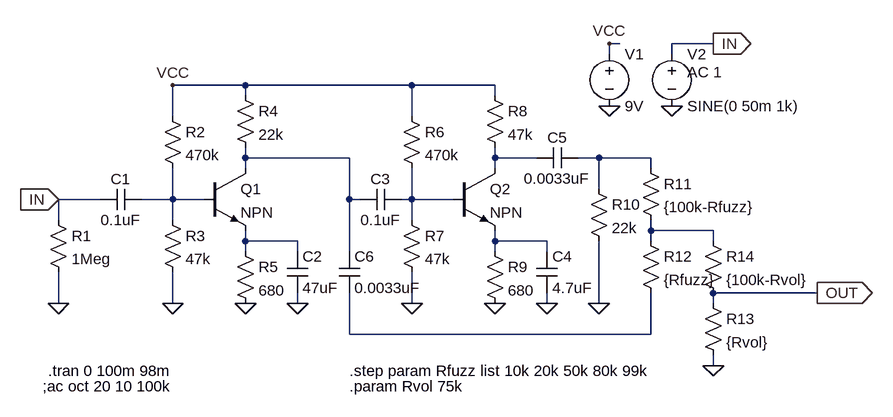
[diagram p0: schematic FoxeyLady.asc]
FoxeyLady.asc, the LTspice schematic file:
Version 4
SHEET 1 1396 680
WIRE 976 -208 960 -208
WIRE 1120 -208 1056 -208
WIRE 960 -192 960 -208
WIRE 1056 -192 1056 -208
WIRE 400 -144 288 -144
WIRE 656 -144 400 -144
WIRE 784 -144 656 -144
WIRE 400 -128 400 -144
WIRE 784 -128 784 -144
WIRE 288 -96 288 -144
WIRE 656 -96 656 -144
WIRE 400 -32 400 -48
WIRE 560 -32 400 -32
WIRE 784 -32 784 -48
WIRE 848 -32 784 -32
WIRE 944 -32 912 -32
WIRE 1024 -32 944 -32
WIRE 400 -16 400 -32
WIRE 784 -16 784 -32
WIRE 1024 -16 1024 -32
WIRE 944 16 944 -32
WIRE 176 32 112 32
WIRE 288 32 288 -16
WIRE 288 32 240 32
WIRE 336 32 288 32
WIRE 560 32 560 -32
WIRE 576 32 560 32
WIRE 656 32 656 -16
WIRE 656 32 640 32
WIRE 720 32 656 32
WIRE 112 64 112 32
WIRE 288 64 288 32
WIRE 656 64 656 32
WIRE 1024 80 1024 64
WIRE 1120 80 1024 80
WIRE 400 96 400 80
WIRE 480 96 400 96
WIRE 784 96 784 80
WIRE 864 96 784 96
WIRE 1024 96 1024 80
WIRE 1120 96 1120 80
WIRE 400 112 400 96
WIRE 480 112 480 96
WIRE 560 112 560 32
WIRE 784 112 784 96
WIRE 864 112 864 96
WIRE 1280 176 1120 176
WIRE 112 192 112 144
WIRE 288 192 288 144
WIRE 480 192 480 176
WIRE 656 192 656 144
WIRE 864 192 864 176
WIRE 944 192 944 96
WIRE 1120 192 1120 176
WIRE 560 240 560 176
WIRE 1024 240 1024 176
WIRE 1024 240 560 240
WIRE 1120 288 1120 272
FLAG 112 192 0
FLAG 288 192 0
FLAG 400 192 0
FLAG 480 192 0
FLAG 656 192 0
FLAG 784 192 0
FLAG 864 192 0
FLAG 944 192 0
FLAG 1120 288 0
FLAG 960 -112 0
FLAG 960 -208 VCC
FLAG 288 -144 VCC
FLAG 112 32 IN
IOPIN 112 32 In
FLAG 1280 176 OUT
IOPIN 1280 176 Out
FLAG 1120 -208 IN
IOPIN 1120 -208 Out
FLAG 1056 -112 0
SYMBOL res 96 48 R0
SYMATTR InstName R1
SYMATTR Value 1Meg
SYMBOL cap 240 16 R90
WINDOW 0 0 32 VBottom 2
WINDOW 3 32 32 VTop 2
SYMATTR InstName C1
SYMATTR Value 0.1uF
SYMBOL res 272 -112 R0
SYMATTR InstName R2
SYMATTR Value 470k
SYMBOL res 272 48 R0
SYMATTR InstName R3
SYMATTR Value 47k
SYMBOL npn 336 -16 R0
SYMATTR InstName Q1
SYMBOL res 384 -144 R0
SYMATTR InstName R4
SYMATTR Value 22k
SYMBOL res 384 96 R0
SYMATTR InstName R5
SYMATTR Value 680
SYMBOL cap 464 112 R0
SYMATTR InstName C2
SYMATTR Value 47uF
SYMBOL cap 640 16 R90
WINDOW 0 0 32 VBottom 2
WINDOW 3 32 32 VTop 2
SYMATTR InstName C3
SYMATTR Value 0.1uF
SYMBOL res 640 -112 R0
SYMATTR InstName R6
SYMATTR Value 470k
SYMBOL res 640 48 R0
SYMATTR InstName R7
SYMATTR Value 47k
SYMBOL npn 720 -16 R0
SYMATTR InstName Q2
SYMBOL res 768 -144 R0
SYMATTR InstName R8
SYMATTR Value 47k
SYMBOL res 768 96 R0
SYMATTR InstName R9
SYMATTR Value 680
SYMBOL cap 848 112 R0
SYMATTR InstName C4
SYMATTR Value 4.7uF
SYMBOL cap 912 -48 R90
WINDOW 0 0 32 VBottom 2
WINDOW 3 32 32 VTop 2
SYMATTR InstName C5
SYMATTR Value 0.0033uF
SYMBOL res 928 0 R0
SYMATTR InstName R10
SYMATTR Value 22k
SYMBOL res 1008 -32 R0
SYMATTR InstName R11
SYMATTR Value {100k-Rfuzz}
SYMBOL res 1008 80 R0
SYMATTR InstName R12
SYMATTR Value {Rfuzz}
SYMBOL res 1104 176 R0
SYMATTR InstName R13
SYMATTR Value {Rvol}
SYMBOL res 1104 80 R0
SYMATTR InstName R14
SYMATTR Value {100k-Rvol}
SYMBOL cap 544 112 R0
SYMATTR InstName C6
SYMATTR Value 0.0033uF
SYMBOL voltage 960 -208 R0
SYMATTR InstName V1
SYMATTR Value 9V
SYMBOL voltage 1056 -208 R0
WINDOW 123 24 44 Left 2
WINDOW 39 0 0 Left 2
SYMATTR Value2 AC 1
SYMATTR InstName V2
SYMATTR Value SINE(0 50m 1k)
TEXT 560 296 Left 2 !.step param Rfuzz list 10k 20k 50k 80k 99k
TEXT 560 320 Left 2 !.param Rvol 75k
TEXT 96 296 Left 2 !.tran 0 100m 98m
TEXT 88 320 Left 2 !;ac oct 20 10 100k

The netlist it stands for:
* FoxeyLady.asc
R1 IN 0 1Meg
C1 N004 IN 0.1uF
R2 VCC N004 470k
R3 N004 0 47k
Q1 N001 N004 N007 0 NPN
R4 VCC N001 22k
R5 N007 0 680
C2 N007 0 47uF
C3 N005 N001 0.1uF
R6 VCC N005 470k
R7 N005 0 47k
Q2 N002 N005 N008 0 NPN
R8 VCC N002 47k
R9 N008 0 680
C4 N008 0 4.7uF
C5 N003 N002 0.0033uF
R10 N003 0 22k
R11 N003 N006 {100k-Rfuzz}
R12 N006 N009 {Rfuzz}
R13 OUT 0 {Rvol}
R14 N006 OUT {100k-Rvol}
C6 N001 N009 0.0033uF
V1 VCC 0 9V
V2 IN 0 SINE(0 50m 1k) AC 1
.model NPN NPN
.model PNP PNP
.lib standard.bjt
.step param Rfuzz list 10k 20k 50k 80k 99k
.param Rvol 75k
.tran 0 100m 98m
;ac oct 20 10 100k
.backanno
.end